# EAGLE design triBot-v2-1 (EAGLE 7.3.0)
CNAME: triBot Board Circuit; CREVISION: 2.1; DESIGNER: Utku Norman
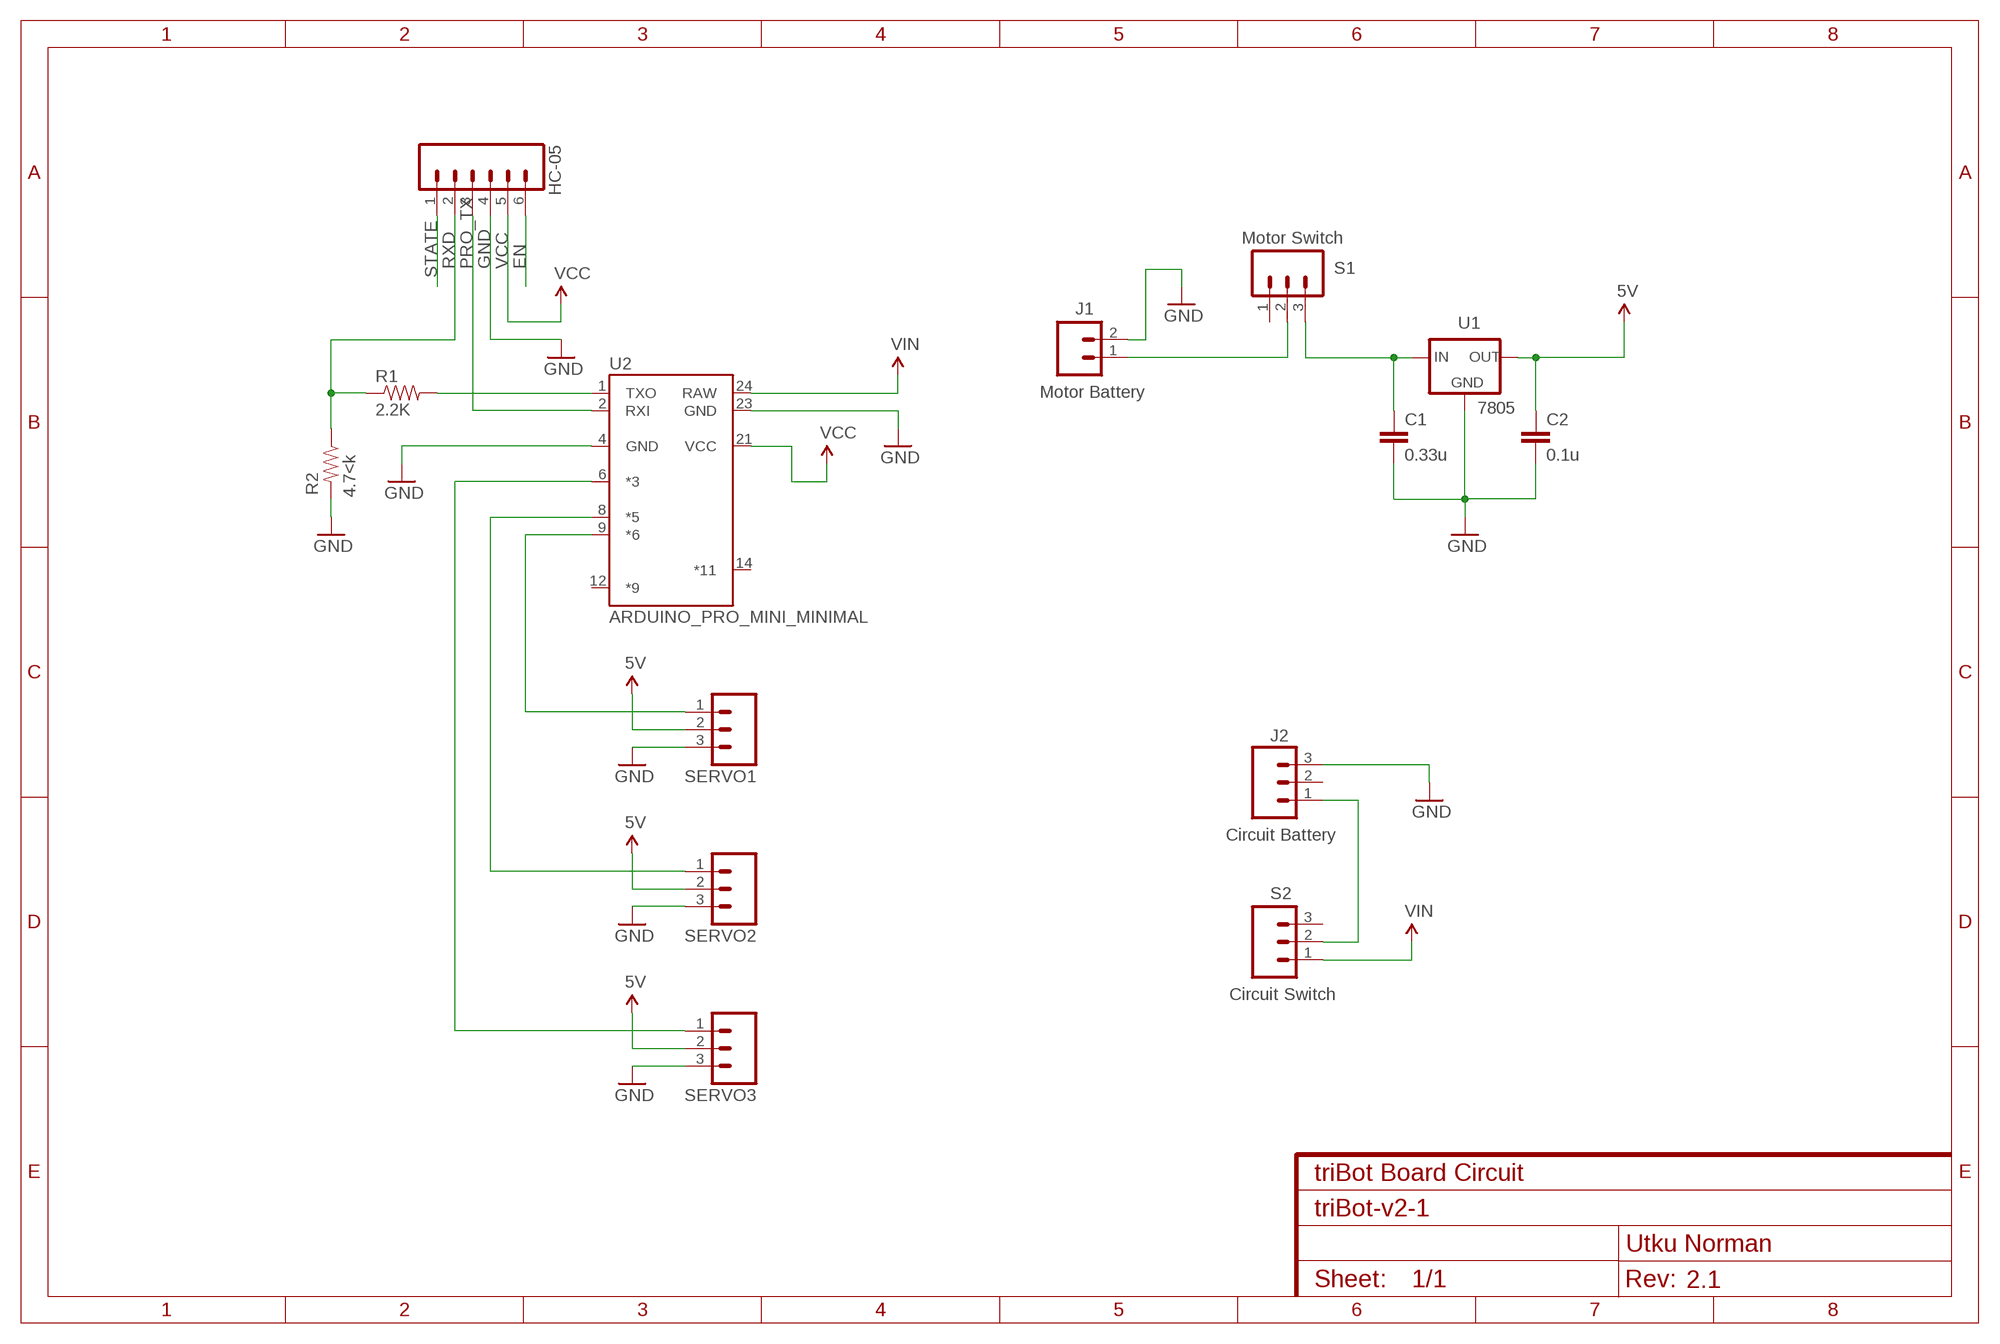
[diagram p0: schematic, sheet 1]

## Parts
C1  0.33u  CAPPTH  [CAP-PTH-SMALL]
C2  0.1u  CAPPTH  [CAP-PTH-SMALL]
HC-05  M06LOCK_LONGPADS  [1X06_LOCK_LONGPADS]
J1  Motor Battery  M025MM  [SCREWTERMINAL-5MM-2]
J2  Circuit Battery  M03LONGPADS  [1X03_LONGPADS]
R1  2.2K  RESISTORKIT  [AXIAL-0.3-KIT]
R2  4.7<k  RESISTORKIT  [AXIAL-0.3-KIT]
S1  Motor Switch  M03-SCREW-5MM  [SCREWTERMINAL-5MM-3]
S2  Circuit Switch  M03LOCK_LONGPADS  [1X03_LOCK_LONGPADS]
SERVO1  M03LONGPADS  [1X03_LONGPADS]
SERVO2  M03LONGPADS  [1X03_LONGPADS]
SERVO3  M03LONGPADS  [1X03_LONGPADS]
U1  7805  V_REG_78XX-TO-220  [TO-220-ALT]
U2  ARDUINO_PRO_MINI_MINIMAL  [ARDUINO_PRO_MINI_MINIMAL]

## Nets
5V: C2.1 SERVO1.2 SERVO2.2 SERVO3.2 U1.OUT
EN: HC-05.6
GND: C1.2 C2.2 HC-05.4 J1.2 J2.3 R2.P$2 SERVO1.3 SERVO2.3 SERVO3.3 U1.GND U2.4(GND) U2.23(GND)
N$1: C1.1 S1.3 U1.IN
N$2: SERVO3.1 U2.6(*3)
N$4: J2.1 S2.2
N$5: SERVO2.1 U2.8(*5)
N$6: SERVO1.1 U2.9(*6)
N$16: J1.1 S1.2
PRO_RX: HC-05.3 U2.2(RXI)
PRO_TX: R1.P$2 U2.1(TXO)
RXD: HC-05.2 R1.P$1 R2.P$1
STATE: HC-05.1
VCC: HC-05.5 U2.21(VCC)
VIN: S2.1 U2.24(RAW)
Unconnected: J2.2 S1.1 S2.3 U2.12(*9) U2.14(*11)

## Library data of the parts
C1 C2 = SparkFun-Capacitors:CAP: Capacitor Standard 0603 ceramic capacitor, and 0.1" leaded capacitor.
HC-05 = SparkFun-Connectors:M06: Header 6 Standard 6-pin 0.1" header. Use with straight break away headers (SKU : PRT-00116), right angle break away headers (PRT-00553), swiss pins (PRT-00743), machine pins (PRT-00117), and female headers (PRT-00115). Molex polarized connector foot print use with SKU : PRT-08094 with associated crimp pins and housings. NOTES ON THE VARIANTS LOCK and LOCK_LONGPADS... This footprint was designed to help hold the alignment of a through-hole component (i.e. 6-pin header) while soldering it into place. You may notice that each hole has been shifted either up or down by 0.005 of an inch from it's more standard position (which is a perfectly straight line). This slight alteration caused the pins (the squares in the middle) to touch the edges of the holes. Because they are alternating, it causes a "brace" to hold the component in place. 0.005 has proven to be the perfect amount of "off-center" position when using our standard breakaway headers. Although looks a little odd when you look at the bare footprint, once you have a header in there, the alteration is very hard to notice. Also,if you push a header all the way into place, it is covered up entirely on the bottom side. This idea of altering the position of holes to aid alignment will be further integrated into the Sparkfun Library for other footprints. It can help hold any component with 3 or more connection pins.
J1 = SparkFun-Connectors:M02: Standard 2-pin 0.1" header. Use with - straight break away headers ( PRT-00116) - right angle break away headers (PRT-00553) - swiss pins (PRT-00743) - machine pins (PRT-00117) - female headers (PRT-00115) Molex polarized connector foot print use with: PRT-08233 with associated crimp pins and housings. 2.54_SCREWTERM for use with PRT-10571. 3.5mm Screw Terminal footprints for PRT-08084 5mm Screw Terminal footprints for use with PRT-08432; STOREFRONT_ID: PRT-08432
J2 S2 SERVO1-SERVO3 = SparkFun-Connectors:M03: Header 3 Standard 3-pin 0.1" header. Use with straight break away headers (SKU : PRT-00116), right angle break away headers (PRT-00553), swiss pins (PRT-00743), machine pins (PRT-00117), and female headers (PRT-00115). Molex polarized connector foot print use with SKU : PRT-08232 with associated crimp pins and housings.
R1 R2 = SparkFun-Passives:RESISTOR: Resistor Basic schematic elements and footprints for 0603, 1206, and PTH resistors.
S1 = SparkFun-Connectors:M03: Header 3 Standard 3-pin 0.1" header. Use with straight break away headers (SKU : PRT-00116), right angle break away headers (PRT-00553), swiss pins (PRT-00743), machine pins (PRT-00117), and female headers (PRT-00115). Molex polarized connector foot print use with SKU : PRT-08232 with associated crimp pins and housings.; STOREFRONT_ID: PRT-08433
U1 = SparkFun-PowerIC:V_REG_78XX: Voltage Regulator Standard 78xx regulator. IGO (Input Ground Output). Spark Fun Electronics SKU : COM-00107; PROD_ID: VREG-08450; SF_ID: COM-00107
U2 = SparkFun-Boards:ARDUINO_PRO_MINI_MINIMAL

## Board
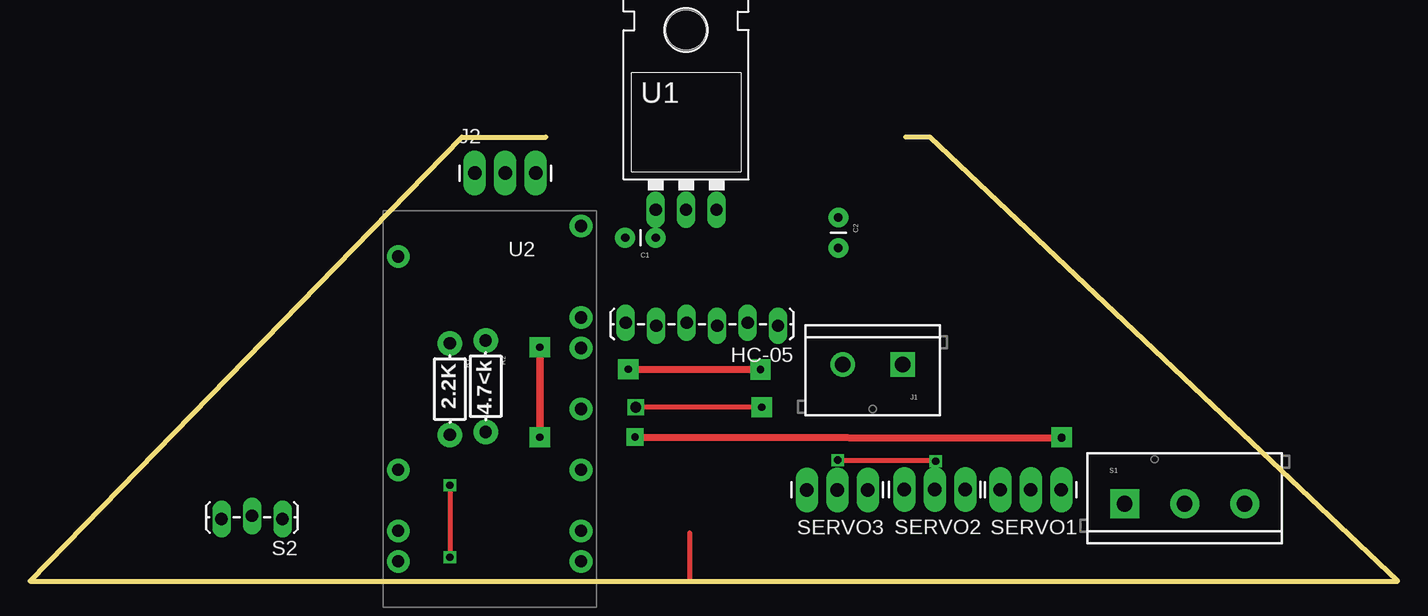
[diagram p1: board, top side]
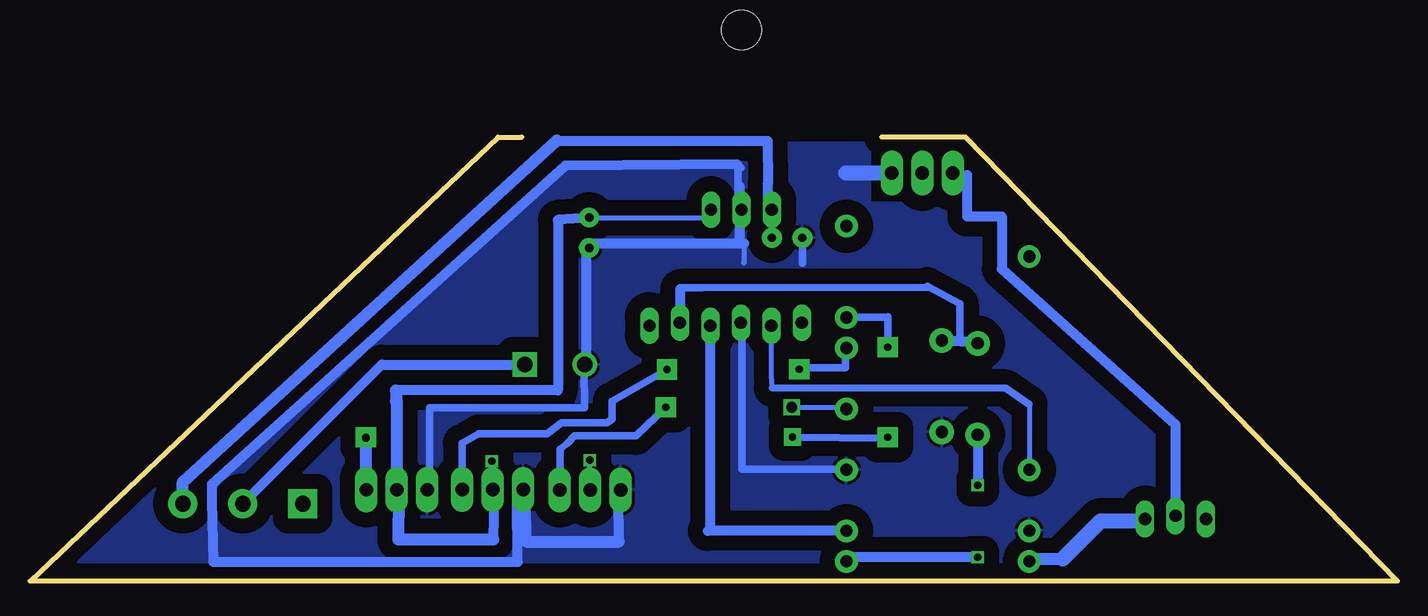
[diagram p2: board, bottom side, seen from below]

Size 114 x 37 mm. Coordinates in mm from the lower left corner, seen from the top.
Outline: 43,37 36,37 0,0 114,0 75,37 73,37
Copper layers (1*16): Top 0.035mm / dielectric 1.5mm / Bottom 0.035mm
Design rules "default": minimum track width 10mil, minimum drill 24mil, track to track 8mil, track to pad 8mil, pad to pad 8mil, via to via 8mil, smd to smd 8mil, copper to edge 40mil, drill to drill 8mil, minimum pad ring 10mil, minimum via ring 8mil, stop-mask expansion 4mil, vias tented up to drill 0mil, thermal gap 10mil

### Footprints (pad centres in the part's own frame; a part is rotated, then mirrored left to right if it is on the bottom)
CAP-PTH-SMALL = drill 0.7 pad 1.651: 1 0,0; 2 2.54,0
1X06_LOCK_LONGPADS = drill 1.016 long: 1 0,0; 2 2.54,-0.254; 3 5.08,0; 4 7.62,-0.254; 5 10.16,0; 6 12.7,-0.254
SCREWTERMINAL-5MM-2 = drill 1.3 pad 2.032 square: 1 0,0 | drill 1.3 pad 2.032: 2 5,0
1X03_LONGPADS = drill 1.118 pad 1.88 long: 1 0,0; 2 2.54,0; 3 5.08,0
AXIAL-0.3-KIT = drill 1.016 pad 2.032: P$1 -3.81,0; P$2 3.81,0
SCREWTERMINAL-5MM-3 = drill 1.3 pad 2.413 square: 1 0,0 | drill 1.3 pad 2.413: 2 5,0; 3 10,0
1X03_LOCK_LONGPADS = drill 1.016 long: 1 0,0; 2 2.54,-0.254; 3 5.08,0
TO-220-ALT = drill 1.016 long: GND 0,-3.81; IN -2.54,-3.81; OUT 2.54,-3.81 | hole 3.302: 0,11.176
ARDUINO_PRO_MINI_MINIMAL = drill 1.016 pad 1.88: 1 -7.62,12.7; 2 -7.62,10.16; 4 -7.62,5.08; 6 -7.62,0; 8 -7.62,-5.08; 9 -7.62,-7.62; 12 -7.62,-15.24; 14 7.62,-12.7; 21 7.62,5.08; 23 7.62,10.16; 24 7.62,12.7

### Placement (x,y rotation side)
C1  52.15,28.61 180 top
C2  67.39,30.3 270 top
HC-05  62.37,21.28 180 top
J1  72.74,18.04 180 top
J2  37.07,34 0 top
R1  35,16 270 top
R2  37.99,16.24 270 top
S1  91.26,6.45 0 top
S2  21.05,5.18 180 top
SERVO1  85.97,7.61 180 top
SERVO2  77.96,7.63 180 top
SERVO3  69.84,7.61 180 top
U1  54.7,34.75 0 top
U2  38.32,14.35 180 top

### Tracks (layer width: path | path; a pad name or v marks a point on that pad's centre or on a via)
5V  (via drill 0.6)
  Top 0.406: v67.33,10.09 75.5,10.09 v75.5,10
  Bottom 0.254: 83.21,7.09 83.21,7.54 SERVO1.2 | 75.21,7.54 75.29,7.39
  Bottom 0.406: 83.5,15 83.43,15 | 75.29,7.39 75.29,7.5 SERVO2.2 75.42,10 v75.5,10 | C2.1 57.24,30.3 U1.OUT | SERVO3.2 67.33,7.61 v67.33,10.09
  Bottom 0.813: 75.29,7.39 75.39,3.46 | C2.1 70,30.11 70,15.9 83.5,15.9
  Bottom 1.016: 83.21,7.09 83.28,3.46 75.39,3.46 | 83.5,15.9 83.5,15 | 83.43,15 SERVO1.2
GND
  Bottom 0.254: 67.89,17.83 67.81,17.83 | 64.92,7.09 64.92,7.54 SERVO3.3 | 72.69,6.86 72.69,7.54 SERVO2.3 72.69,6.86 | 54.86,32.92 U1.GND 55.09,33.15 54.84,32.85 | 73.38,6.86 72.69,6.86 | 54.87,28.48 54.46,28.13 | 67.67,18.06 J1.2
  Bottom 0.406: 46.5,9.5 46.5,9.33 46.49,9.34 | 46,34 | R2.P$2 38.5,12.43 38.5,12.5 | 54.46,28.13 54.5,28.13 54.5,26.5
  Bottom 0.61: 54.63,20.42 54.63,9.33 46.5,9.33 | 67.81,17.83 67.77,14.47 80.7,14.47 80.7,8.27 80.89,7.77 SERVO1.3 | 67.89,17.83 J1.2 | 55,34.5 55,33.04 U1.GND | 55.04,34.73 54.74,34.44 | 49.61,26.5 C1.2
  Bottom 0.813: 64.91,3.3 64.92,7.09 | 72.69,6.86 72.64,3.3 | 54.86,31.32 54.86,32.92 | 73.38,6.86 73.34,1.6 98.73,1.6 98.84,6.71 98.84,8.09 69.39,34.63 55.04,34.73 | 67.67,18.06 67.67,28.13 54.46,28.13 | 54.84,32.85 54.87,28.48
  Bottom 1.016: 72.64,3.3 64.91,3.3
  Bottom 1.27: J2.3 46,34
  pour Bottom (isolate 1.27): 44,36.5 76,36.5 111.5,1 48,0 48,-0.5 1,0.5 28.5,28 28.5,25 29,24.5 32.5,24.5 33.5,25.5 33.5,31.5 44,31.5
N$1
  Bottom 0.406: U1.IN 52.5,30.94
  Bottom 0.61: C1.1 52.16,29.65 U1.IN
  Bottom 0.813: 70.1,36.7 52.52,36.68 52.5,33.08 52.5,30.94
  Bottom 1.016: S1.3 101.26,8.24 70.1,36.7
N$2  (via drill 0.6 pad 1.42, 0.6 pad 1.68, 0.9)
  Top 0.406: v61,14.5 v50.5,14.5
  Bottom 0.406: v50.5,14.5 45.94,14.5 U2.6
  Bottom 0.61: v61,14.5 63.5,12.1 68.6,12.1 69.2,11.5 69.8,11 SERVO3.1
N$3
  Top 0.406: 55,0 55,4
N$4
  Bottom 0.254: 18.52,5.49 S2.2
  Bottom 0.61: 35.89,33.83 J2.1
  Bottom 0.813: 18.52,5.49 18.52,13.03 33,26 33,30.4 35.89,30.4 35.89,33.83
N$5  (via drill 0.6 pad 1.68)
  Top 0.61: v49.88,17.66 v60.89,17.63
  Bottom 0.406: SERVO2.1 77.5,7.17 77.5,7 | U2.8 46.04,19.43 | 49.88,17.8 v49.88,17.66
  Bottom 0.61: v60.89,17.63 65.5,15 65.5,13.5 65.9,13.2 69.7,13.2 70.9,12.3 76.6,12.3 78,11.5 78,7.5 77.5,7 | 46.04,19.43 46.04,17.8 49.88,17.8
N$6  (via drill 0.6 pad 1.42, 0.6 pad 1.68)
  Top 0.61: v86,11.9 v50.44,12.01 | v42.5,19.5 v42.5,12
  Bottom 0.61: v42.5,12 42.6,11.9 v50.44,12.01 | v42.5,19.5 42.5,22.05 42.5,21.97 U2.9
  Bottom 1.016: SERVO1.1 v86,11.9
N$8  (via drill 0.6 pad 1.68)
  other vias: 86,12
N$16
  Bottom 0.813: S1.2 84.67,18.04 J1.1
PRO_RX
  Bottom 0.406: 57.5,4.19 57.5,4.5 57.29,4.5
  Bottom 0.813: U2.2 57.5,4.19 | 57.29,4.5 HC-05.3
PRO_TX  (via drill 0.6)
  Top 0.406: v35,8 v35,2
  Bottom 0.406: 45.59,2 U2.1
  Bottom 0.813: R1.P$2 v35,8 | v35,2 45.59,2
RXD
  Bottom 0.406: 39.17,24.49 39.19,24.58 | 35.19,20 R1.P$1 | 37.94,20 R2.P$1 | 59.75,24.44 59.5,24.44 59.5,24.5
  Bottom 0.61: 39.17,24.49 57.97,24.46 59.75,24.44 59.77,24.33 | 39.19,24.58 36.5,23.1 36.5,20
  Bottom 0.813: 35.19,20 36.5,20 37.94,20 | HC-05.2 59.77,24.33
VCC
  Bottom 0.406: 52.1,16.11 52.19,17.17 HC-05.5 | 30.74,14.74 30.7,14.74 U2.21
  Bottom 0.61: 30.74,14.74 32.65,16.07 52.1,16.11
VIN
  Bottom 0.254: 21.26,5.03 S2.1
  Bottom 0.406: 30.7,1.83 U2.24
  Bottom 1.016: 27.93,1.83 30.7,1.83
  Bottom 1.27: 21.26,5.03 24.73,5.03 27.93,1.83